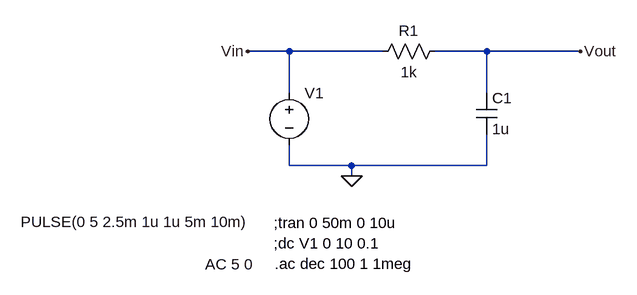
[diagram p0: schematic RCcircuit.asc]
RCcircuit.asc, the LTspice schematic file:
Version 4
SHEET 1 880 680
WIRE 48 64 -16 64
WIRE 192 64 48 64
WIRE 352 64 272 64
WIRE 496 64 352 64
WIRE 48 128 48 64
WIRE 352 128 352 64
WIRE 48 240 48 208
WIRE 144 240 48 240
WIRE 352 240 352 192
WIRE 352 240 144 240
WIRE 144 256 144 240
FLAG 144 256 0
FLAG 496 64 Vout
FLAG -16 64 Vin
SYMBOL voltage 48 112 R0
WINDOW 3 -413 215 Left 2
WINDOW 123 -129 280 Left 2
WINDOW 39 0 0 Left 0
SYMATTR InstName V1
SYMATTR Value PULSE(0 5 2.5m 1u 1u 5m 10m)
SYMATTR Value2 AC 5 0
SYMBOL res 288 48 R90
WINDOW 0 0 56 VBottom 2
WINDOW 3 32 56 VTop 2
SYMATTR InstName R1
SYMATTR Value 1k
SYMBOL cap 336 128 R0
SYMATTR InstName C1
SYMATTR Value 1u
TEXT 24 328 Left 2 !;tran 0 50m 0 10u
TEXT 24 360 Left 2 !;dc V1 0 10 0.1
TEXT 26 391 Left 2 !.ac dec 100 1 1meg

The netlist it stands for:
* RCcircuit.asc
V1 Vin 0 PULSE(0 5 2.5m 1u 1u 5m 10m) AC 5 0
R1 Vout Vin 1k
C1 Vout 0 1u
;tran 0 50m 0 10u
;dc V1 0 10 0.1
.ac dec 100 1 1meg
.backanno
.end